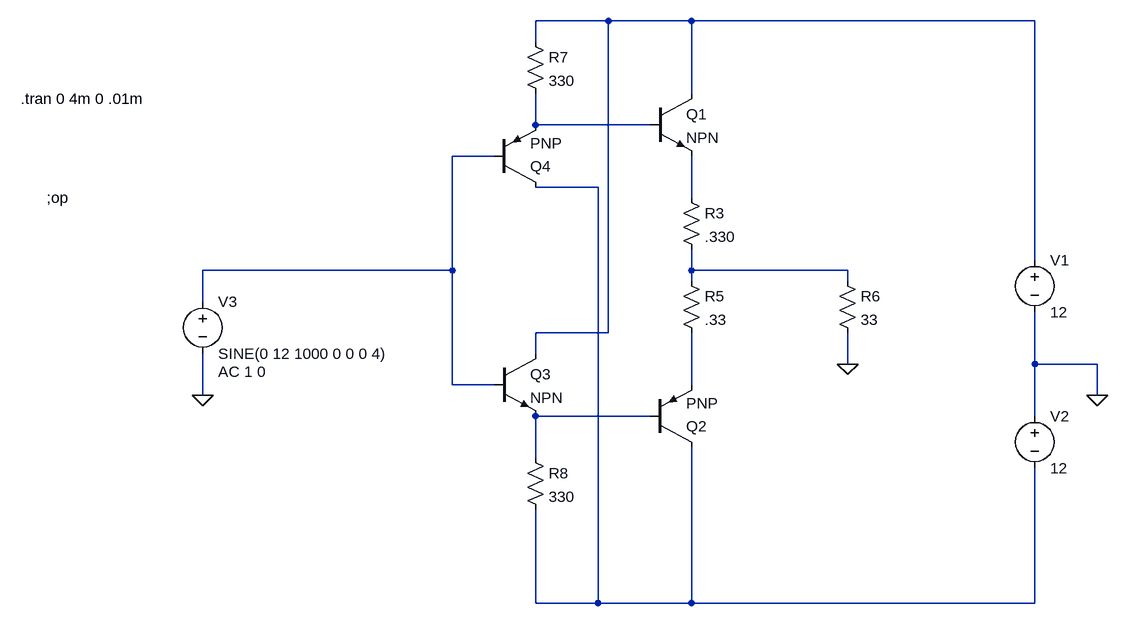
[diagram p0: schematic claseab6.asc]
claseab6.asc, the LTspice schematic file:
Version 4
SHEET 1 1172 680
WIRE 400 -544 288 -544
WIRE 528 -544 400 -544
WIRE 1056 -544 528 -544
WIRE 288 -512 288 -544
WIRE 528 -432 528 -544
WIRE 288 -384 288 -432
WIRE 464 -384 288 -384
WIRE 224 -336 160 -336
WIRE 384 -288 288 -288
WIRE 528 -272 528 -336
WIRE 1056 -176 1056 -544
WIRE 160 -160 160 -336
WIRE 160 -160 -224 -160
WIRE 528 -160 528 -192
WIRE 768 -160 528 -160
WIRE 528 -144 528 -160
WIRE 768 -144 768 -160
WIRE -224 -112 -224 -160
WIRE 400 -64 400 -544
WIRE 400 -64 288 -64
WIRE 288 -32 288 -64
WIRE 768 -16 768 -64
WIRE 1056 -16 1056 -96
WIRE 1152 -16 1056 -16
WIRE 160 16 160 -160
WIRE 224 16 160 16
WIRE 528 16 528 -64
WIRE -224 32 -224 -32
WIRE 1152 32 1152 -16
WIRE 464 64 288 64
WIRE 1056 64 1056 -16
WIRE 288 128 288 64
WIRE 288 352 288 208
WIRE 384 352 384 -288
WIRE 384 352 288 352
WIRE 528 352 528 112
WIRE 528 352 384 352
WIRE 1056 352 1056 144
WIRE 1056 352 528 352
FLAG 1152 32 0
FLAG -224 32 0
FLAG 768 -16 0
SYMBOL voltage 1056 -192 R0
WINDOW 123 0 0 Left 2
WINDOW 39 0 0 Left 2
SYMATTR InstName V1
SYMATTR Value 12
SYMBOL voltage 1056 48 R0
WINDOW 123 0 0 Left 2
WINDOW 39 0 0 Left 2
SYMATTR InstName V2
SYMATTR Value 12
SYMBOL voltage -224 -128 R0
WINDOW 123 24 124 Left 2
WINDOW 39 0 0 Left 2
SYMATTR Value2 AC 1 0
SYMATTR InstName V3
SYMATTR Value SINE(0 12 1000 0 0 0 4)
SYMBOL npn 464 -432 R0
SYMATTR InstName Q1
SYMBOL pnp 464 112 M180
SYMATTR InstName Q2
SYMBOL npn 224 -32 R0
SYMATTR InstName Q3
SYMBOL pnp 224 -288 M180
SYMATTR InstName Q4
SYMBOL res 512 -288 R0
SYMATTR InstName R3
SYMATTR Value .330
SYMBOL res 512 -160 R0
SYMATTR InstName R5
SYMATTR Value .33
SYMBOL res 752 -160 R0
SYMATTR InstName R6
SYMATTR Value 33
SYMBOL res 272 -528 R0
SYMATTR InstName R7
SYMATTR Value 330
SYMBOL res 272 112 R0
SYMATTR InstName R8
SYMATTR Value 330
TEXT -504 -424 Left 2 !.tran 0 4m 0 .01m
TEXT -464 -272 Left 2 !;op

The netlist it stands for:
* claseab6.asc
V1 N001 0 12
V2 0 N004 12
V3 N003 0 SINE(0 12 1000 0 0 0 4) AC 1 0
Q1 N001 N002 N005 0 NPN
Q2 N004 N008 N007 0 PNP
Q3 N001 N003 N008 0 NPN
Q4 N004 N003 N002 0 PNP
R3 N005 N006 .330
R5 N006 N007 .33
R6 N006 0 33
R7 N001 N002 330
R8 N008 N004 330
.model NPN NPN
.model PNP PNP
.lib standard.bjt
.tran 0 4m 0 .01m
;op
.backanno
.end